# Altium schematic sheet Esquematico.SchDoc
size A3
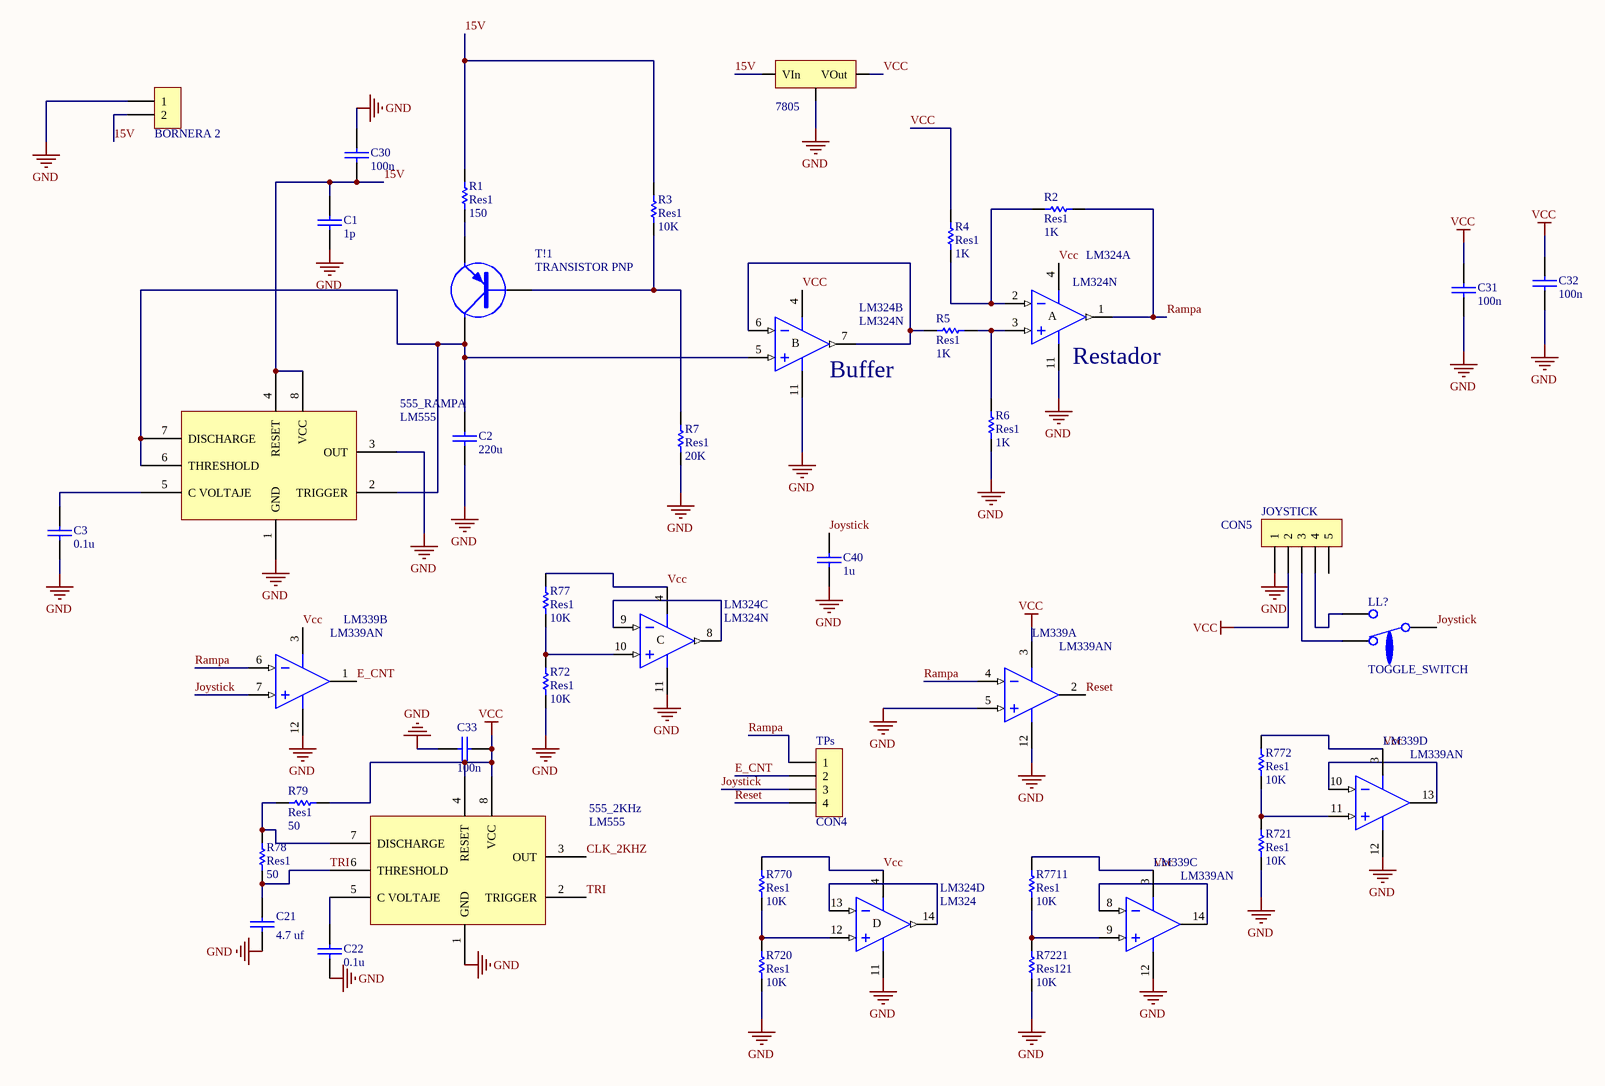
[diagram p0: Esquematico.SchDoc]

## Parts
555_2KHz  LM555  [DIP8]
555_RAMPA  LM555  [DIP8]
?  BORNERA 2  [BORNERA2]
C1  1p  [CAP100]
C2  220u  [CAP100]
C3  0.1u  [CAP100]
C21  4.7 uf  [CAP100]
C22  0.1u  [CAP100]
C30  100n  [0805]
C31  100n  [0805]
C32  100n  [0805]
C33  100n  [0805]
C40  1u  [CAP200]
JOYSTICK  CON5  [SIP5]
LL?  TOGGLE_SWITCH  [TOOGLE SWITCH SIMPLE]
LM324  LM324N  [N014]  (parts A,B,C,D of 4)
LM339  LM339AN  [646-06]  (parts A,B,C,D of 4)
R1  Res1  value 150  [AXIAL-0.3]
R2  Res1  value 1K  [AXIAL-0.3]
R3  Res1  value 10K  [AXIAL-0.3]
R4  Res1  value 1K  [AXIAL-0.3]
R5  Res1  value 1K  [AXIAL-0.3]
R6  Res1  value 1K  [AXIAL-0.3]
R7  Res1  value 20K  [AXIAL-0.3]
R72  Res1  value 10K  [AXIAL-0.3]
R77  Res1  value 10K  [AXIAL-0.3]
R78  Res1  value 50  [AXIAL-0.3]
R79  Res1  value 50  [AXIAL-0.3]
R720  Res1  value 10K  [AXIAL-0.3]
R721  Res1  value 10K  [AXIAL-0.3]
R770  Res1  value 10K  [AXIAL-0.3]
R772  Res1  value 10K  [AXIAL-0.3]
R7221  Res121  value 10K  [AXIAL-0.3]
R7711  Res1  value 10K  [AXIAL-0.3]
Regulador_de_Tensión  7805  [TO-220 V]
T!1  TRANSISTOR PNP  [TO92]
TPs  CON4  [SIP4]

## Nets
GND: 555_2KHz.1(GND) 555_RAMPA.1(GND) 555_RAMPA.3(OUT) ?.1 C1.2 C2.2 C3.2 C21.2 C22.2 C30.2 C31.2 C32.2 C33.2 C40.2 JOYSTICK.1 LM324.11(V-) LM339.5(IN+) LM339.12(GND) R6.1 R7.1 R72.1 R720.1 R721.1 R7221.1 Regulador_de_Tensión.2(GND)
VCC: 555_2KHz.4(RESET) 555_2KHz.8(VCC) C31.1 C32.1 C33.1 JOYSTICK.2 LM324.4(V+) LM339.3(V+) R4.2 R77.2 R79.1 R770.2 R772.2 R7711.2 Regulador_de_Tensión.3(VOut)
15V: 555_RAMPA.4(RESET) 555_RAMPA.8(VCC) ?.2 C1.1 C30.1 R1.2 R3.2 Regulador_de_Tensión.1(VIn)
CLK_2KHZ: 555_2KHz.3(OUT)
E_CNT: LM339.1(OUT) TPs.2
Joystick: C40.1 LL?.2(C) LM339.7(IN+) TPs.3
Rampa: LM324.1(OUT) LM339.4(IN-) LM339.6(IN-) R2.1 TPs.1
Reset: LM339.2(OUT) TPs.4
TRI: 555_2KHz.2(TRIGGER) 555_2KHz.6(THRESHOLD) C21.1 R78.1
Net555_2KHz_5: 555_2KHz.5(C_VOLTAJE) C22.1
Net555_2KHz_7: 555_2KHz.7(DISCHARGE) R78.2 R79.2
Net555_RAMPA_2: 555_RAMPA.2(TRIGGER) 555_RAMPA.6(THRESHOLD) 555_RAMPA.7(DISCHARGE) C2.1 LM324.5(IN+) T!1.2(C)
Net555_RAMPA_5: 555_RAMPA.5(C_VOLTAJE) C3.1
NetJOYSTICK_3: JOYSTICK.3 LL?.3(NC)
NetJOYSTICK_4: JOYSTICK.4 LL?.1(NA)
NetLM324_2: LM324.2(IN-) R2.2 R4.1
NetLM324_3: LM324.3(IN+) R5.1 R6.2
NetLM324_6: LM324.6(IN-) LM324.7(OUT) R5.2
NetLM324_8: LM324.8(OUT) LM324.9(IN-)
NetLM324_10: LM324.10(IN+) R72.2 R77.1
NetLM324_12: LM324.12(IN+) R720.2 R770.1
NetLM324_13: LM324.13(IN-) LM324.14(OUT)
NetLM339_8: LM339.8(IN-) LM339.14(OUT)
NetLM339_9: LM339.9(IN+) R7221.2 R7711.1
NetLM339_10: LM339.10(IN-) LM339.13(OUT)
NetLM339_11: LM339.11(IN+) R721.2 R772.1
NetR1_1: R1.1 T!1.3(E)
NetR3_1: R3.1 R7.2 T!1.1(B)

Not connected (* = marked no-connect by the designer): JOYSTICK 5

## Notes on the sheet
- (near LM324) Buffer
- (near LM324) Restador
- (in symbol LM324N, part A) A
- (in symbol LM324N, part B) B
- (in symbol LM324N, part C) C
- (in symbol LM324N, part D) D

## Library data of the parts
555_2KHz 555_RAMPA = LM555: Timer
C1-C3 C21 C22 C30-C33 C40 = CAP
LL? = TOGGLE_SWITCH: Pulsador con reteción
LM324 = LM324N: Quadruple Operational Amplifier; Published: 16-Jan-2001; LatestRevisionDate: 04-Mar-2005; LatestRevisionNote: Stylized 3D Model Added.; DatasheetVersion: Feb-1997; PackageVersion: Oct-1995; PackageReference: N014; Publisher: Altium Limited; PackageDescription: DIP; 14 Leads; Row Spacing 7.62 mm; Pitch 2.54 mm; ComponentLink1Description: Manufacturer Link; ComponentLink1URL: http://www.ti.com/; ComponentLink2Description: Datasheet; ComponentLink2URL: http://www-s.ti.com/sc/ds/lm324.pdf
LM339 = LM339AN: Quad Single-Supply Comparator; Published: 17-Jul-2002; LatestRevisionDate: 06-Jun-2005; LatestRevisionNote: Stylized 3D Model Added.; DatasheetVersion: 1988; PackageVersion: 1997; PackageReference: 646-06; Publisher: Altium Limited; PackageDescription: DIP; 14 Leads; Row Spacing 7.62 mm; Pitch 2.54 mm; ComponentLink1Description: Manufacturer Link; ComponentLink1URL: http://www.onsemi.com/site/products/taxonomy/0,4438,133,00.html
R1-R7 R72 R77-R79 R720 R721 R770 R772 R7221 R7711 = Res1: Resistor; Published: 8-Jun-2000; LatestRevisionDate: 17-Jul-2002; LatestRevisionNote: Re-released for DXP Platform.; PackageReference: AXIAL-0.3; Publisher: Altium Limited; PackageDescription: Axial Device, Thru-Hole; 2 Leads; 0.3 in Pin Spacing
Regulador_de_Tensión = 78XX: REGULDOR POSITIVO